# EAGLE design controller_v1 (EAGLE 7.1.0)
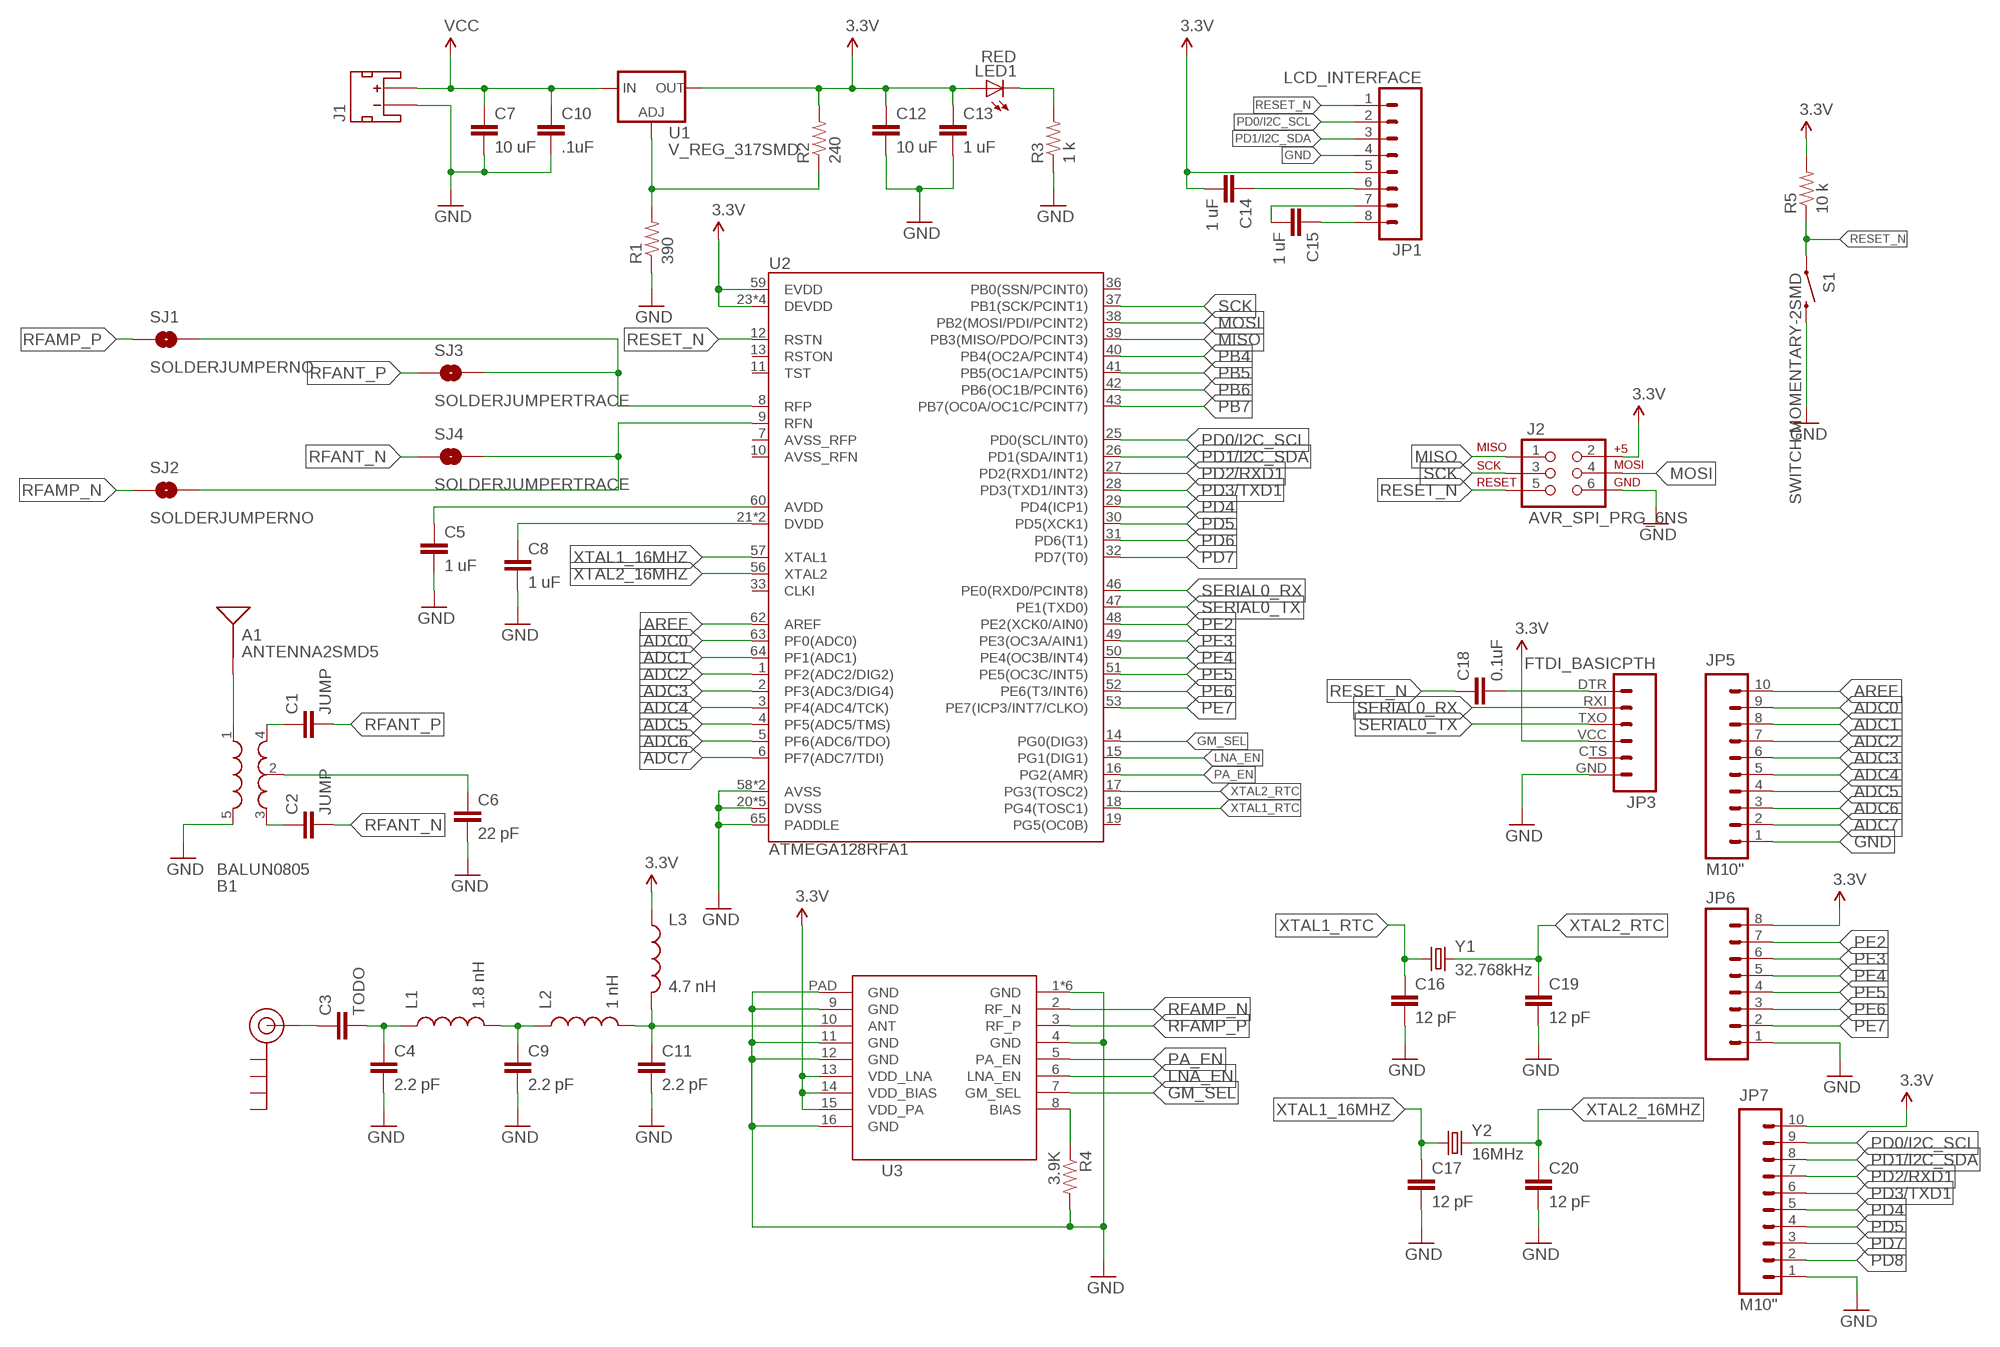
[diagram p0: schematic, sheet 1]

## Parts
A1  ANTENNA2SMD5  [ANTENNA-CHIP5]
B1  BALUN0805  [BALUN]
C1  JUMP  CAP0805  [0805]
C2  JUMP  CAP0805  [0805]
C3  TODO  CAP0805  [0805]
C4  2.2 pF  CAP0805  [0805]
C5  1 uF  CAP0805  [0805]
C6  22 pF  CAP0805  [0805]
C7  10 uF  CAP0805  [0805]
C8  1 uF  CAP0805  [0805]
C9  2.2 pF  CAP0805  [0805]
C10  .1uF  CAP0805  [0805]
C11  2.2 pF  CAP0805  [0805]
C12  10 uF  CAP0805  [0805]
C13  1 uF  CAP0805  [0805]
C14  1 uF  CAP0805  [0805]
C15  1 uF  CAP0805  [0805]
C16  12 pF  CAP0805  [0805]
C17  12 pF  CAP0805  [0805]
C18  0.1uF  CAP0805  [0805]
C19  12 pF  CAP0805  [0805]
C20  12 pF  CAP0805  [0805]
J1  BATT  JST_2MM_MALE  [JST-2-SMD]
J2  AVR_SPI_PRG_6NS  [2X3-NS]
J$1  SMA_EDGE  [SMA-EDGE]
JP1  LCD_INTERFACE  M081X08  [1X08]
JP3  FTDI_BASICPTH  [FTDI_BASIC]
JP5  M10"  [1X10]
JP6  M081X08  [1X08]
JP7  M10"  [1X10]
L1  1.8 nH  INDUCTOR0805  [0805]
L2  1 nH  INDUCTOR0805  [0805]
L3  4.7 nH  INDUCTOR0805  [0805]
LED1  RED  LED0603  [LED-0603]
R1  390  RESISTOR0805-RES  [0805]
R2  240  RESISTOR0805-RES  [0805]
R3  1 k  RESISTOR0805-RES  [0805]
R4  3.9K  RESISTOR0805-RES  [0805]
R5  10 k  RESISTOR0805-RES  [0805]
S1  SWITCH-MOMENTARY-2SMD  [TACTILE_SWITCH_SMD]
SJ1  SOLDERJUMPERNO  [SJ_2S-NO]
SJ2  SOLDERJUMPERNO  [SJ_2S-NO]
SJ3  SOLDERJUMPERTRACE  [SJ_2S-TRACE]
SJ4  SOLDERJUMPERTRACE  [SJ_2S-TRACE]
U1  V_REG_317SMD  [SOT223]
U2  ATMEGA128RFA1  [QFN-64]
U3  RF_AMPLIFIER  CC2592QF  [QFN65P400X400X100-17N]
Y1  32.768kHz  CRYSTAL32-SMD  [CRYSTAL-32KHZ-SMD]
Y2  16MHz  CRYSTAL5X3  [CRYSTAL-SMD-5X3]

## Nets
3.3V: C12.1 C13.1 C14.2 J2.2 JP1.5 JP3.VCC JP6.8 JP7.10 L3.1 LED1.A R2.2 R5.2 U1.2(OUT) U2.23(DEVDD) U2.34(DEVDD) U2.44(DEVDD) U2.54(DEVDD) U2.59(EVDD) U3.13(VDD_LNA) U3.14(VDD_BIAS) U3.15(VDD_PA)
ADC0: JP5.9 U2.63(PF0(ADC0))
ADC1: JP5.8 U2.64(PF1(ADC1))
ADC2: JP5.7 U2.1(PF2(ADC2/DIG2))
ADC3: JP5.6 U2.2(PF3(ADC3/DIG4))
ADC4: JP5.5 U2.3(PF4(ADC4/TCK))
ADC5: JP5.4 U2.4(PF5(ADC5/TMS))
ADC6: JP5.3 U2.5(PF6(ADC6/TDO))
ADC7: JP5.2 U2.6(PF7(ADC7/TDI))
AREF: JP5.10 U2.62(AREF)
GM_SEL: U2.14(PG0(DIG3)) U3.7(GM_SEL)
GND: B1.5(GND) C4.2 C5.2 C6.2 C7.2 C8.2 C9.2 C10.2 C11.2 C12.2 C13.2 C16.2 C17.2 C19.2 C20.2 J1.1(-) J2.6 JP1.4 JP3.GND JP5.1 JP6.1 JP7.1 R1.1 R3.1 R4.2 S1.3 U2.20(DVSS) U2.24(DVSS) U2.35(DVSS) U2.45(DVSS) U2.55(DVSS) U2.58(AVSS) U2.61(AVSS) U2.65(PADDLE) U3.1(GND) U3.4(GND) U3.9(GND) U3.11(GND) U3.12(GND) U3.16(GND) U3.P$1(GND) U3.P$2(GND) U3.P$3(GND) U3.P$4(GND) U3.P$5(GND) U3.PAD(GND)
LNA_EN: U2.15(PG1(DIG1)) U3.6(LNA_EN)
MISO: J2.1 U2.39(PB3(MISO/PDO/PCINT3))
MOSI: J2.4 U2.38(PB2(MOSI/PDI/PCINT2))
N$1: C9.1 L1.2 L2.1
N$2: C18.2 JP3.DTR
N$3: C11.1 L2.2 L3.2 U3.10(ANT)
N$4: C3.2 C4.1 L1.1
N$5: SJ1.2 SJ3.2 U2.8(RFP)
N$6: SJ2.2 SJ4.2 U2.9(RFN)
N$7: R4.1 U3.8(BIAS)
N$8: C3.1 J$1.SIG(SIGNAL)
N$9: B1.4(OUT1) C1.1
N$10: B1.3(OUT2) C2.1
N$11: B1.2(GND) C6.1
N$12: A1.FEED(SIGNAL) B1.1(IN)
N$13: R1.2 R2.1 U1.1(ADJ)
N$14: LED1.C R3.2
N$15: C5.1 U2.60(AVDD)
N$16: C8.1 U2.21(DVDD) U2.22(DVDD)
N$17: C14.1 JP1.6
N$18: C15.2 JP1.7
N$19: C15.1 JP1.8
PA_EN: U2.16(PG2(AMR)) U3.5(PA_EN)
PB4: U2.40(PB4(OC2A/PCINT4))
PB5: U2.41(PB5(OC1A/PCINT5))
PB6: U2.42(PB6(OC1B/PCINT6))
PB7: U2.43(PB7(OC0A/OC1C/PCINT7))
PD0/I2C_SCL: JP1.2 JP7.9 U2.25(PD0(SCL/INT0))
PD1/I2C_SDA: JP1.3 JP7.8 U2.26(PD1(SDA/INT1))
PD2/RXD1: JP7.7 U2.27(PD2(RXD1/INT2))
PD3/TXD1: JP7.6 U2.28(PD3(TXD1/INT3))
PD4: JP7.5 U2.29(PD4(ICP1))
PD5: JP7.4 U2.30(PD5(XCK1))
PD6: U2.31(PD6(T1))
PD7: JP7.3 U2.32(PD7(T0))
PD8: JP7.2
PE2: JP6.7 U2.48(PE2(XCK0/AIN0))
PE3: JP6.6 U2.49(PE3(OC3A/AIN1))
PE4: JP6.5 U2.50(PE4(OC3B/INT4))
PE5: JP6.4 U2.51(PE5(OC3C/INT5))
PE6: JP6.3 U2.52(PE6(T3/INT6))
PE7: JP6.2 U2.53(PE7(ICP3/INT7/CLKO))
RESET_N: C18.1 J2.5 JP1.1 R5.1 S1.1 U2.12(RSTN)
RFAMP_N: SJ2.1 U3.2(RF_N)
RFAMP_P: SJ1.1 U3.3(RF_P)
RFANT_N: C2.2 SJ4.1
RFANT_P: C1.2 SJ3.1
SCK: J2.3 U2.37(PB1(SCK/PCINT1))
SERIAL0_RX: JP3.RXI U2.46(PE0(RXD0/PCINT8))
SERIAL0_TX: JP3.TXO U2.47(PE1(TXD0))
VCC: C7.1 C10.1 J1.2(+) U1.3(IN)
XTAL1_16MHZ: C17.1 U2.57(XTAL1) Y2.1
XTAL1_RTC: C16.1 U2.18(PG4(TOSC1)) Y1.X1
XTAL2_16MHZ: C20.1 U2.56(XTAL2) Y2.3
XTAL2_RTC: C19.1 U2.17(PG3(TOSC2)) Y1.X2
Unconnected: J1.NC1(PAD1) J1.NC2(PAD2) J$1.GND@0(GND) J$1.GND@1(GND) J$1.GND@2(GND) J$1.GND@3(GND) JP3.CTS U2.7(AVSS_RFP) U2.10(AVSS_RFN) U2.11(TST) U2.13(RSTON) U2.19(PG5(OC0B)) U2.33(CLKI) U2.36(PB0(SSN/PCINT0))

## Library data of the parts
A1 = Controller:ANTENNA2: Chip antenna Single endded antenna. Common with smaller chip antennas. CHIP4 package is the GPS Chip Antenna SKU: GPS-08418. CHIP5 package is 2.4GHz chip antenna SKU: WRL-00144.
B1 = Controller:BALUN: 0805 footprint balun- Ember 351/357
C1-C6 C8 C9 C11 C14-C20 = Controller:CAP: Capacitor Standard 0603 ceramic capacitor, and 0.1" leaded capacitor.
C7 C10 C12 C13 = ATmega128RFA1-DevBoard:CAP: Capacitor Standard 0603 ceramic capacitor, and 0.1" leaded capacitor.
J1 = Controller:JST_2MM_MALE: Mates to single-cell LiPo batteries. CONN-08352; PROD_ID: CONN-08352
J2 = Controller:AVR_SPI_PRG_6: AVR ISP 6 Pin This is the reduced ISP connector for AVR programming. Common on Arduino. This footprint will take up less PCB space and can be used with a 10-pin to 6-pin adapter such as SKU: BOB-08508
J$1 = Controller:SMA_EDGE: SMA Antenna Connector End launch SMA connector. The paste layer has been removed so that the connector can be hand soldered onto the board after reflow.
JP1 JP6 = Controller:M08: Header 8 Standard 8-pin 0.1" header. Use with straight break away headers (SKU : PRT-00116), right angle break away headers (PRT-00553), swiss pins (PRT-00743), machine pins (PRT-00117), and female headers (PRT-00115).
JP3 = Controller:FTDI_BASIC: FTDI Basic header with labels
JP5 JP7 = Controller:M10: Header 10 Standard 10-pin 0.1" header. Use with straight break away headers (SKU : PRT-00116), right angle break away headers (PRT-00553), swiss pins (PRT-00743), machine pins (PRT-00117), and female headers (PRT-00115).
L1-L3 = Controller:INDUCTOR: Inductors Basic Inductor/Choke - 0603 and 1206. Footprints are not proven and vary greatly between part numbers. SRN6045- 33uH, 20% 1.4A SDR0403-560KL - 56uH, 10%, 500mA RMS/740mA peak
LED1 = Controller:LED: LEDs Standard schematic elements and footprints for 5mm, 3mm, 1206, and 0603 sized LEDs. 5mm - Spark Fun Electronics SKU : COM-00529 (and others)
R1 R2 = ATmega128RFA1-DevBoard:RESISTOR: Resistor Basic schematic elements and footprints for 0603, 1206, and PTH resistors.
R3-R5 = Controller:RESISTOR: Resistor Basic schematic elements and footprints for 0603, 1206, and PTH resistors.
S1 = Controller:SWITCH-MOMENTARY-2: Various NO switches- pushbuttons, reed, etc
SJ1-SJ4 = Controller:SOLDERJUMPER: Solder Jumper Standard SMD solder jumper. Used to automate production. Two varients : Normally Open and Normally Closed are the same, but have different paste layers. NC will have a large amount of paste and should jumper during reflow.
U1 = Controller:V_REG_317: Voltage Regulator Standard LM317 adjustable voltage regulator. AOI (Adjust Output Input). Google 'LM317 Calculator' for easy to use app to get the two resistor values needed. 240/720 for 5V output. 240/390 for 3.3V output. Spark Fun Electronics SKU : COM-00527
U2 = Controller:ATMEGA128RFA1: ATmega128RFA1 8-bit AVR Microcontroller with Low Power 2.4GHz Transceiver for ZigBee and IEEE 802.15.4
U3 = Controller:CC2592
Y1 Y2 = Controller:CRYSTAL: Various standard crystals. Proven footprints. Spark Fun Electronics SKU : COM-00534

## Board
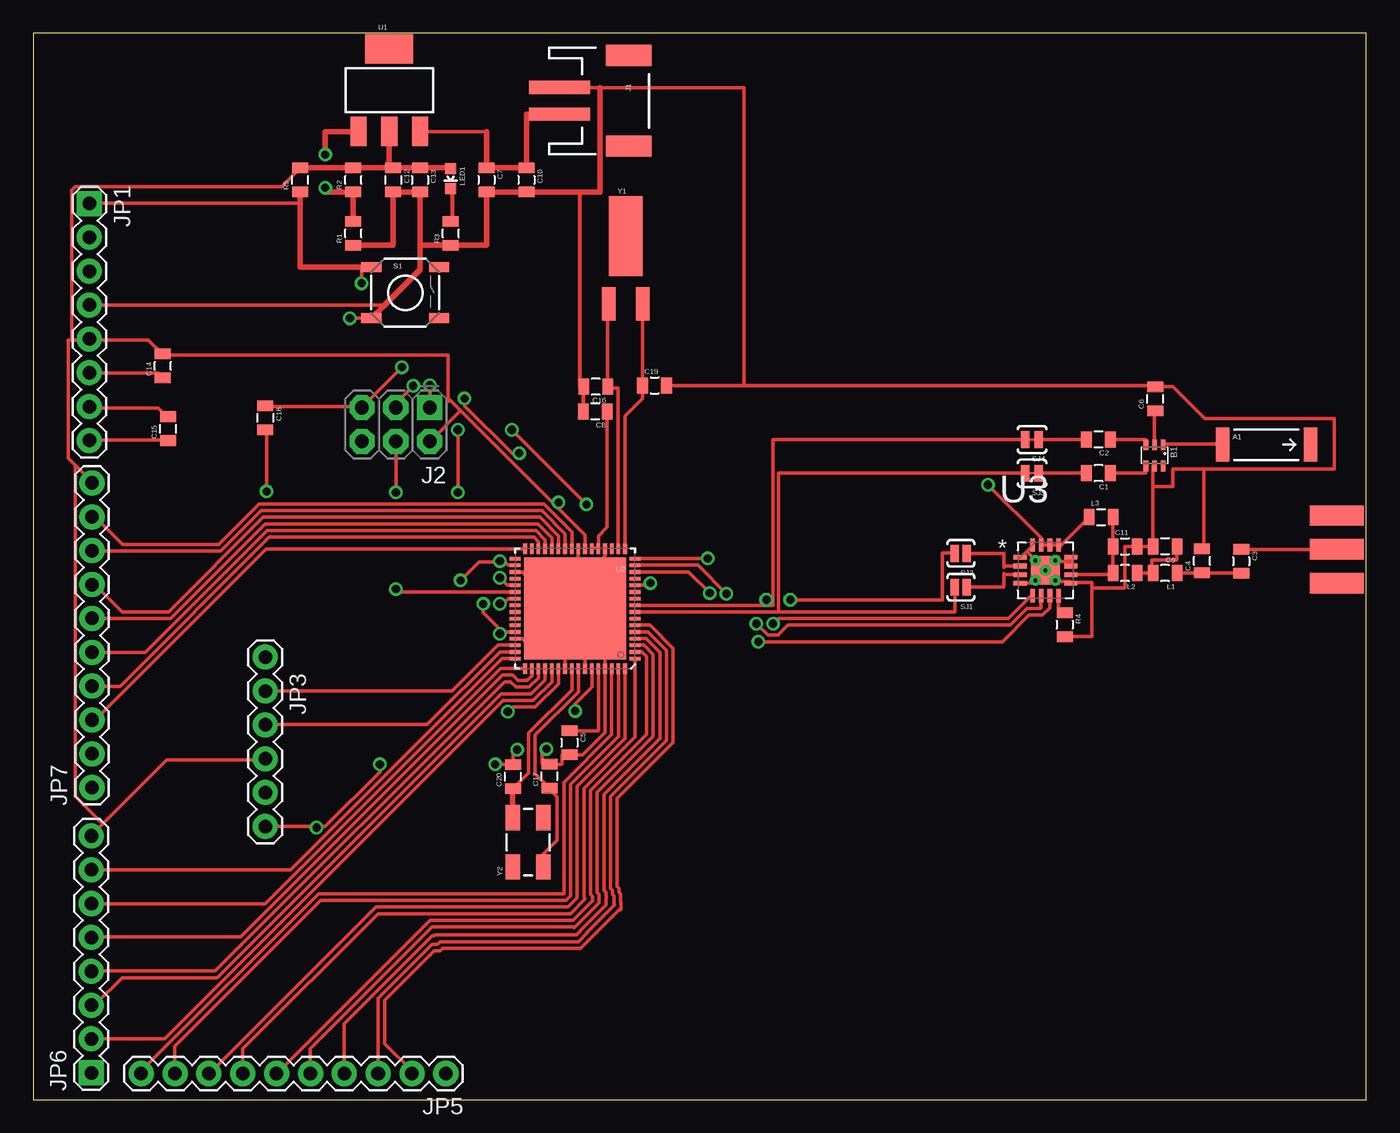
[diagram p1: board, top side]
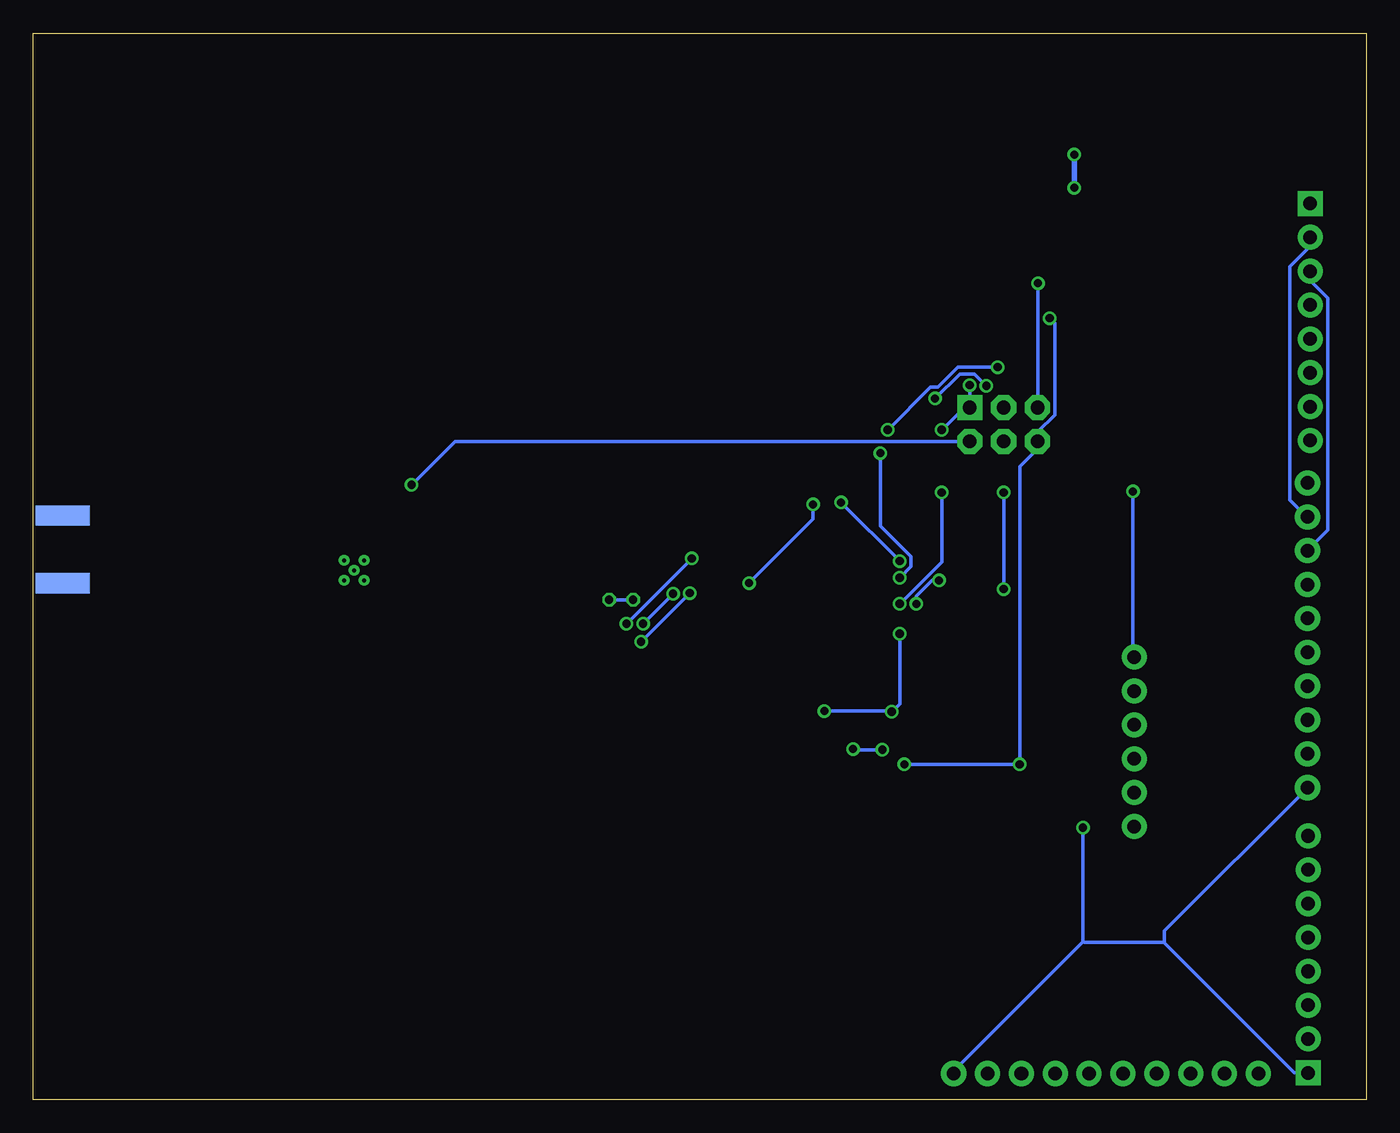
[diagram p2: board, bottom side, seen from below]

Size 100 x 80 mm. Coordinates in mm from the lower left corner, seen from the top.
Outline: 0,0 100,0 100,80 0,80 0,0
Copper layers (1*16): Top 0.035mm / dielectric 1.5mm / Bottom 0.035mm
Design rules "default": minimum track width 10mil, minimum drill 24mil, track to track 8mil, track to pad 8mil, pad to pad 8mil, via to via 8mil, smd to smd 8mil, copper to edge 40mil, drill to drill 8mil, minimum pad ring 10mil, minimum via ring 8mil, stop-mask expansion 4mil, vias tented up to drill 0mil, thermal gap 10mil

### Footprints (pad centres in the part's own frame; a part is rotated, then mirrored left to right if it is on the bottom)
ANTENNA-CHIP5 = smd 1.016 x 2.54: FEED -3.302,0; NC 3.302,0
BALUN = smd 0.35 x 0.8: 1 -0.65,-0.8; 2 0,-0.8; 3 0.65,-0.8; 4 0.65,0.8; 5 0,0.8; 6 -0.65,0.8
0805 = smd 0.8 x 1.2: 1 -0.9,0; 2 0.9,0
JST-2-SMD = smd 1 x 4.6: 1 -1,-3.7; 2 1,-3.7 | smd 1.6 x 3.4: NC1 -3.4,1.5; NC2 3.4,1.5
2X3-NS = drill 1.016 pad 1.88 square: 1 -2.54,-1.27 | drill 1.016 pad 1.88 octagon: 2 -2.54,1.27; 3 0,-1.27; 4 0,1.27; 5 2.54,-1.27; 6 2.54,1.27
SMA-EDGE = smd 1.524 x 4.064: GND@0 0,0; GND@1 5.08,0; SIG 2.54,0 | smd 1.524 x 4.064 bottom: GND@2 0,0; GND@3 5.08,0
1X08 = drill 1.016 pad 1.88 square: 1 0,0 | drill 1.016 pad 1.88: 2 2.54,0; 3 5.08,0; 4 7.62,0; 5 10.16,0; 6 12.7,0; 7 15.24,0; 8 17.78,0
FTDI_BASIC = drill 1.016 pad 1.88: CTS 10.16,0; DTR 0,0; GND 12.7,0; RXI 2.54,0; TXO 5.08,0; VCC 7.62,0
1X10 = drill 1.016 pad 1.88: 1 0,0; 2 2.54,0; 3 5.08,0; 4 7.62,0; 5 10.16,0; 6 12.7,0; 7 15.24,0; 8 17.78,0; 9 20.32,0; 10 22.86,0
LED-0603 = smd 0.8 x 0.8: A 0,-0.75; C 0,0.75
TACTILE_SWITCH_SMD = smd 1.524 x 0.762: 1 -2.54,1.905; 2 2.54,1.905; 3 -2.54,-1.905; 4 2.54,-1.905
SJ_2S-NO = smd 0.635 x 1.27: 1 -0.45,0; 2 0.45,0
SJ_2S-TRACE = smd 0.635 x 1.27: 1 -0.508,0; 2 0.508,0
SOT223 = smd 1.219 x 2.235: 1 -2.311,-3.099; 2 0,-3.099; 3 2.311,-3.099 | smd 3.6 x 2.2: 4 0,3.099
QFN-64 = smd 0.8 x 0.28: 1 -4.5,3.75; 2 -4.5,3.25; 3 -4.5,2.75; 4 -4.5,2.25; 5 -4.5,1.75; 6 -4.5,1.25; 7 -4.5,0.75; 8 -4.5,0.25; 9 -4.5,-0.25; 10 -4.5,-0.75; 11 -4.5,-1.25; 12 -4.5,-1.75; 13 -4.5,-2.25; 14 -4.5,-2.75; 15 -4.5,-3.25; 16 -4.5,-3.75; 33 4.5,-3.75; 34 4.5,-3.25; 35 4.5,-2.75; 36 4.5,-2.25; 37 4.5,-1.75; 38 4.5,-1.25; 39 4.5,-0.75; 40 4.5,-0.25; 41 4.5,0.25; 42 4.5,0.75; 43 4.5,1.25; 44 4.5,1.75; 45 4.5,2.25; 46 4.5,2.75; 47 4.5,3.25; 48 4.5,3.75 | smd 0.28 x 0.8: 17 -3.75,-4.5; 18 -3.25,-4.5; 19 -2.75,-4.5; 20 -2.25,-4.5; 21 -1.75,-4.5; 22 -1.25,-4.5; 23 -0.75,-4.5; 24 -0.25,-4.5; 25 0.25,-4.5; 26 0.75,-4.5; 27 1.25,-4.5; 28 1.75,-4.5; 29 2.25,-4.5; 30 2.75,-4.5; 31 3.25,-4.5; 32 3.75,-4.5; 49 3.75,4.5; 50 3.25,4.5; 51 2.75,4.5; 52 2.25,4.5; 53 1.75,4.5; 54 1.25,4.5; 55 0.75,4.5; 56 0.25,4.5; 57 -0.25,4.5; 58 -0.75,4.5; 59 -1.25,4.5; 60 -1.75,4.5; 61 -2.25,4.5; 62 -2.75,4.5; 63 -3.25,4.5; 64 -3.75,4.5 | smd 7.65 x 7.65: 65 0,0
QFN65P400X400X100-17N = smd 1 x 0.35: 1 -1.9,0.975; 2 -1.9,0.325; 3 -1.9,-0.325; 4 -1.9,-0.975; 9 1.9,-0.975; 10 1.9,-0.325; 11 1.9,0.325; 12 1.9,0.975 | smd 0.35 x 1: 5 -0.975,-1.9; 6 -0.325,-1.9; 7 0.325,-1.9; 8 0.975,-1.9; 13 0.975,1.9; 14 0.325,1.9; 15 -0.325,1.9; 16 -0.975,1.9 | drill 0.3 pad 0.406: P$1 -0.75,0.75; P$2 0.75,0.75; P$3 -0.75,-0.75; P$4 0.75,-0.75; P$5 0,0 | smd 2.16 x 2.16: PAD 0,0
CRYSTAL-32KHZ-SMD = smd 2.5 x 6: SHEILD 0,5.08 | smd 1 x 2.5: X1 -1.27,0; X2 1.27,0
CRYSTAL-SMD-5X3 = smd 1.9 x 1.1: 1 -1.85,-1.15; 2 1.85,-1.15; 3 1.85,1.15; 4 -1.85,1.15

### Placement (x,y rotation side)
A1  92.51,49.13 0 top
B1  84.12,48.33 180 top
C1  79.91,46.99 180 top
C2  79.91,49.53 180 top
C3  90.62,40.38 270 top
C4  87.67,40.42 90 top
C5  40.23,26.77 270 top
C6  84.17,52.57 90 top
C7  34,69 270 top
C8  42.16,51.62 180 top
C9  84.9,41.5 180 top
C10  37,69 270 top
C11  81.9,41.5 0 top
C12  27,69 270 top
C13  29,69 270 top
C14  9.71,55.05 90 top
C15  10.11,50.34 90 top
C16  42.19,53.48 180 top
C17  38.73,24.27 90 top
C18  17.41,51.16 270 top
C19  46.61,53.58 0 top
C20  35.98,24.23 90 top
J1  43.18,74.93 270 top
J2  27.2,50.65 180 top
J$1  97.79,43.82 270 top
JP1  4.21,67.23 270 top
JP3  17.4,33.19 270 top
JP5  30.95,1.95 180 top
JP6  4.35,2 90 top
JP7  4.4,23.4 90 top
L1  84.9,39.5 180 top
L2  81.9,39.5 180 top
L3  80.1,43.7 0 top
LED1  31.3,69.1 180 top
R1  24,65 90 top
R2  24,69 90 top
R3  31.32,65 90 top
R4  77.38,35.63 270 top
R5  20,69 90 top
S1  27.9,60.54 0 top
SJ1  69.59,38.44 180 top
SJ2  69.59,40.98 180 top
SJ3  74.93,46.99 180 top
SJ4  74.93,49.53 180 top
U1  26.71,75.73 0 top
U2  40.64,36.83 180 top
U3  75.94,39.71 0 top
Y1  44.45,59.69 0 top
Y2  37.12,19.31 90 top

### Tracks (layer width: path | path; a pad name or v marks a point on that pad's centre or on a via)
3.3V  (via drill 0.6, 0.61, 0.61 pad 0.61)
  Top 0.254: L3.1 79.15,43.62 77.03,41.5 U3.13 76.9,41.62 76.28,41.62 U3.14 76.15,41.62 75.65,41.62 U3.15 75.62,41.75 75.62,42.12 v71.62,46.12 | 5.19,20.69 10,25.5 17.38,25.5 JP3.VCC | 5.19,20.69 4.38,19.88 JP6.8 | 3.19,47.56 2.62,48.12 2.62,57 2.88,57 | 3.19,47.56 4.38,46.38 JP7.10 | 2.88,57 4.12,57 JP1.5 4.25,57 8.62,57 9.62,56 C14.2 9.75,55.88 31.12,55.88 31.12,52.5 | 2.88,57 2.88,68.25 3.12,68.5 18.62,68.5 19.88,69.75 R5.2 | 5.19,20.69 3.12,22.75 3.12,47.5 3.19,47.56 | 31.12,52.5 31.12,52.38 | 32.06,51.69 31.25,52.5 31.12,52.5 | 32.06,51.69 39.17,44.58 | 39.17,44.58 41.38,42.38 41.38,41.38 U2.23 | 32.06,51.69 J2.2 | U2.54 39.4,32.3 39.4,31.2 37.65,29.45 36,29.45 35.62,29.07 v35.6,29.1 | U2.44 36.1,35.1 35.15,35.1 v35,34.95 35.1,35.2 33.75,36.55 v33.75,37.2 | v39.4,44.8 39.17,44.58 | U2.34 36.1,40.1 35.6,40.1 35.3,40.4 v35,40.4 34.9,40.35 33.45,40.35 v32.05,38.95 | v40.65,29.15 40.65,29.7 41.9,30.95 41.9,32.3 U2.59
  Top 0.406: R5.2 R2.2 C12.1 | C12.1 C13.1 31.3,69.9 LED1.A | C12.1 26.71,69.9 U1.2
  Bottom 0.254: v71.62,46.12 68.38,49.38 J2.2 | v35,34.95 35,29.7 v35.6,29.1 35.7,29.15 v40.65,29.15 | v35,40.4 v39.4,44.8 | v32.05,38.95 32.6,38.95 33.75,37.8 v33.75,37.2
ADC0
  Top 0.254: JP5.9 10.6,1.95 10.6,4 21.55,14.95 39.95,14.95 40.3,15.3 40.3,23.65 43.89,27.24 U2.63 43.9,32.3
ADC1
  Top 0.254: JP5.8 13.2,1.95 25.7,14.45 40.1,14.45 40.8,15.15 40.8,23.5 44.39,27.09 U2.64 44.4,32.3
ADC2
  Top 0.254: JP5.7 15.7,3.8 25.85,13.95 40.3,13.95 41.4,15.05 41.35,15.15 41.3,15.2 41.3,23.35 45.14,27.19 U2.1 45.1,33.05
ADC3
  Top 0.254: JP5.6 29.75,13.45 40.5,13.45 41.95,14.9 41.95,15.2 41.9,15.3 41.8,15.4 41.8,23.2 46,27.4 46,33.25 45.65,33.6 45.15,33.6 U2.2
ADC4
  Top 0.254: JP5.5 20.75,1.95 20.75,3.8 29.9,12.95 40.5,12.95 40.55,12.9 40.65,12.95 42.45,14.75 42.45,15.4 42.3,15.55 42.3,23.05 46.5,27.25 46.5,33.4 45.8,34.1 45.15,34.1 U2.3
ADC5
  Top 0.254: JP5.4 23.3,1.95 23.3,5.7 29.9,12.3 30.05,12.3 30.15,12.35 40.75,12.35 41.05,12.65 41.05,12.7 42.95,14.6 42.95,15.15 43,15.2 42.95,15.3 42.95,15.55 42.8,15.7 42.8,22.9 47,27.1 47,33.55 45.95,34.6 45.15,34.6 U2.4
ADC6
  Top 0.254: JP5.3 25.85,1.95 25.85,7.6 29.9,11.65 30.25,11.65 30.35,11.7 30.5,11.85 40.9,11.85 41.55,12.5 41.55,12.55 43.6,14.6 43.55,14.7 43.55,15.3 43.45,15.4 43.45,15.7 43.3,15.85 43.3,22.75 47.5,26.95 47.5,33.7 46.1,35.1 45.15,35.1 U2.5
ADC7
  Top 0.254: JP5.2 28.4,2.15 26.35,4.2 26.35,7.45 29.75,10.85 29.8,10.85 29.85,10.95 30.05,11.15 30.5,11.15 30.7,11.35 41.05,11.35 43.95,14.25 44.05,14.25 44.1,14.35 44.1,14.75 44.05,14.8 44.05,15.45 43.95,15.55 43.95,15.85 43.8,16 43.8,22.6 48,26.8 48,33.85 46.25,35.6 45.15,35.6 U2.6
AREF
  Top 0.254: JP5.10 8.1,2.15 21.4,15.45 39.8,15.45 39.8,23.8 43.39,27.39 U2.62 43.4,32.3
GM_SEL  (via drill 0.61 pad 0.61)
  Top 0.254: v50.75,38 49.15,39.6 45.15,39.6 U2.14 | v54.4,34.35 72.7,34.35 74.7,36.35 75.7,36.35 76.25,36.9 76.25,37.8 U3.7
  Bottom 0.254: v54.4,34.35 v50.75,38
GND  (via drill 0.61, 0.61 pad 0.61)
  Top 0.254: R4.2 79.4,34.73 79.4,38.4 | 79.4,38.4 79.4,38.8 77.84,38.8 U3.9 77.78,38.88 76.78,38.88 U3.P$4 U3.PAD | 74.53,41.12 74.9,41.5 U3.16 | 74.53,41.12 74.15,40.75 U3.1 | 74.53,41.12 U3.P$1 U3.PAD | 77.9,40.38 77.9,40.62 U3.12 | 77.9,40.38 77.9,40.12 U3.11 | U3.4 74.15,38.75 75.03,38.75 75.15,38.88 U3.PAD | 77.9,40.38 76.78,40.38 U3.PAD | U3.P$3 75.28,39 U3.PAD | 76.03,39.75 U3.PAD | U3.P$2 76.78,40.5 U3.PAD | 79.4,38.4 81.9,38.4 81.9,41.5 C11.2 C9.2 84,46 | 87.8,47.3 97.6,47.3 97.6,51.1 87.9,51.1 85.5,53.5 84.2,53.5 C6.2 84.17,53.58 53.3,53.58 | 87.8,47.3 85.5,47.3 85.5,46 84,46 | B1.5 84,47.53 84,46 | 87.5,41.32 C4.2 87.8,41.32 87.8,47.3 | 47.6,53.5 C19.2 | 47.5,53.7 C19.2 | J1.1 42.5,75.93 53.3,75.93 53.3,53.58 | C19.2 53.3,53.58 | v36.3,26.25 36,25.95 36,25.15 C20.2 35.9,25.15 v34.65,25.15 | v38.5,26.3 38.15,25.95 38.15,25.2 38.2,25.15 38.65,25.15 C17.2 38.85,25.15 39.6,25.15 39.65,25.2 39.65,25.85 40.1,25.85 C5.2 40.25,25.85 41.2,25.85 42.9,27.55 42.9,32.2 U2.61 42.88,32.38 42.88,33.38 42.75,33.5 41.38,33.5 | 21.25,20.5 21.9,20.5 26,24.6 v26,25.15 | 21.25,20.5 JP3.GND | v21.25,20.4 21.25,20.5 | 41.25,33.38 39.88,33.38 39.88,32.38 U2.55 | 41.25,33.38 41.38,33.25 41.38,32.38 U2.58 | 41.38,33.5 41.25,33.5 41.25,33.38 | 41.38,33.5 41.38,36.88 41,36.88 U2.65 | JP1.4 4.25,59.62 26.12,59.62 26.24,59.51 | v23.75,58.62 25.25,58.62 S1.3 | U2.24 40.88,41.25 40.88,36.88 U2.65 | U2.65 39.75,33.4 37.85,33.4 36.65,34.6 36.15,34.6 U2.45 | U2.35 36.15,39.6 36.65,39.6 39.4,36.85 40.55,36.85 U2.65 | U2.65 41,40.45 42.55,40.45 42.9,40.8 42.9,41.3 U2.20
  Top 0.305: C16.2 | C16.2 41,53.48 41,68.1 | C16.2 41.26,53.48 C8.2
  Top 0.406: 42.5,75.93 42.5,68.1 41,68.1 C10.2 C7.2 34,64.1 R3.1 29,64.1 | 29,64.1 C13.2 C12.2 27,64.1 R1.1 | S1.3 26.24,59.51 29,62.27 29,64.1 | 39.48,76 J1.1
  Bottom 0.254: v36.3,26.25 38.45,26.25 v38.5,26.3 | v34.65,25.15 v26,25.15 26,47.5 24.75,48.75 24.75,49.38 J2.6 24.62,49.5 24.62,50.12 23.38,51.38 23.38,58.25 v23.75,58.62 | 21.25,11.85 v21.25,20.4 | 21.25,11.85 30.95,2.15 JP5.1 | JP6.1 5.4,2 15.2,11.8 | 15.2,11.8 21.15,11.8 21.25,11.85 | JP7.1 15.15,12.65 15.15,11.9 15.2,11.8
LNA_EN  (via drill 0.61 pad 0.61)
  Top 0.254: U3.6 75.6,36.9 75.55,36.85 74.55,36.85 73.3,35.6 56.6,35.6 55.95,34.95 55.9,34.85 55.1,34.85 v54.25,35.7 | v52,37.95 49.85,40.1 45.15,40.1 U2.15
  Bottom 0.254: v54.25,35.7 v52,37.95
MISO  (via drill 0.61 pad 0.61)
  Top 0.254: v29.75,53.6 29.75,51.95 J2.1 | v31.85,45.55 v31.85,50.25 | v35,37.2 35.25,37.2 35.65,37.6 36.1,37.6 U2.39
  Bottom 0.254: v29.75,53.6 29.75,52.35 v31.85,50.25 | v31.85,45.55 31.85,40.35 v35,37.2
MOSI  (via drill 0.61 pad 0.61)
  Top 0.254: U2.38 27.2,38.08 v27.2,38.3 | v27.2,45.55 J2.4
  Bottom 0.254: v27.2,38.3 v27.2,45.55
N$1
  Top 0.254: L2.1 L1.2 83.9,39.5 83.9,40.5 85.8,40.5 C9.1
N$2  (via drill 0.61)
  Top 0.254: v17.5,45.62 17.5,50.25 C18.2
  Bottom 0.254: v17.5,45.62 17.5,33.25 JP3.DTR
N$3
  Top 0.254: L3.2 C11.1 L2.2 81,39.38 U3.10
N$4
  Top 0.254: L1.1 87.67,39.5 C4.1 90.62,39.52 C3.2
N$5
  Top 0.254: U2.8 55.9,36.58 | 55.9,36.58 55.9,47 SJ3.2 | 55.9,36.58 69.14,36.58 SJ1.2
N$6  (via drill 0.61)
  Top 0.254: U2.9 55,37.08 | 55,37.08 55.5,37.08 55.5,49.53 SJ4.2 | 55,37.08 v55,37.5 | v56.8,37.5 68.2,37.5 68.2,41 69.14,41 SJ2.2
  Bottom 0.254: v55,37.5 v56.8,37.5
N$7
  Top 0.254: R4.1 76.92,36.53 U3.8
N$8
  Top 0.254: C3.1 J$1.SIG
N$9
  Top 0.254: C1.1 83.47,46.99 B1.4
N$10
  Top 0.254: C2.1 83.47,49.53 B1.3
N$11
  Top 0.254: C6.1 84.12,51.67 B1.2
N$12
  Top 0.254: A1.FEED 89.2,49.2 84.8,49.2 B1.1
N$13  (via drill 0.6)
  Top 0.406: R1.2 R2.1 22,68.1 22,68.3 v21.9,68.4 | U1.1 21.9,72.63 v21.9,70.9
  Bottom 0.406: v21.9,68.4 v21.9,70.9
N$14
  Top 0.305: R3.2 31.4,65.9 31.4,68.4 31.3,68.4 LED1.C
N$15
  Top 0.254: C5.1 40.25,27.65 42.35,27.65 42.4,27.7 42.4,32.3 U2.60
N$16
  Top 0.254: U2.22 42,41.38 42.38,41.38 U2.21 42.4,41.5 42.4,42.3 43.05,42.95 43.05,51.6 C8.1
N$17
  Top 0.254: C14.1 9.62,54.25 9.38,54.5 4.25,54.5 JP1.6
N$18
  Top 0.254: C15.2 10,51.25 9.38,51.88 4.25,51.88 JP1.7
N$19
  Top 0.254: C15.1 10,49.5 4.25,49.5 JP1.8
PA_EN  (via drill 0.61 pad 0.61)
  Top 0.254: 74.9,37.8 U3.5 74.8,37.75 73.15,36.1 55.9,36.1 v55.5,35.7 | v50.6,40.6 45.15,40.6 U2.16
  Bottom 0.254: v55.5,35.7 v50.6,40.6
PD0/I2C_SCL
  Top 0.254: U2.25 40.4,41.35 40.4,42.6 38.3,44.7 16.95,44.7 13.9,41.65 6.7,41.65 4.65,43.7 4.4,43.7 JP7.9
  Bottom 0.254: JP1.2 4.25,64.62 4.25,64 5.75,62.5 5.75,45 4.5,43.75 JP7.9
PD1/I2C_SDA
  Top 0.254: U2.26 39.9,41.35 39.9,42.45 38.15,44.2 17.1,44.2 14.05,41.15 4.4,41.15 JP7.8
  Bottom 0.254: JP1.3 4.12,62.12 4.12,61.38 2.88,60.12 2.88,42.75 4.38,41.25 JP7.8
PD2/RXD1
  Top 0.254: U2.27 39.4,41.35 39.4,42.3 38,43.7 17.25,43.7 10.15,36.6 6.65,36.6 4.65,38.6 4.4,38.6 JP7.7
PD3/TXD1
  Top 0.254: JP7.6 10.3,36.1 17.4,43.2 37.85,43.2 38.9,42.15 38.9,41.35 U2.28
PD4
  Top 0.254: U2.29 38.4,41.35 38.4,42 37.7,42.7 17.55,42.7 8.4,33.55 JP7.5
PD5
  Top 0.254: U2.30 37.9,41.35 37.9,41.85 37.55,42.2 17.7,42.2 6.5,31 4.4,31 JP7.4
PD7
  Top 0.254: U2.32 36.85,41.3 17.45,41.3 4.65,28.5 4.4,28.5 JP7.3
PE2
  Top 0.254: 36.12,33 U2.48 36.05,33.1 35.15,33.1 19.3,17.25 JP6.7
PE3
  Top 0.254: JP6.6 17.4,14.7 35.05,32.35 36.85,32.35 U2.49
PE4
  Top 0.254: JP6.5 4.35,12.2 15.55,12.2 35.2,31.85 35.95,31.85 36.35,31.45 37.05,31.45 37.4,31.8 37.4,32.3 U2.50
PE5
  Top 0.254: JP6.4 4.35,9.65 13.65,9.65 35.35,31.35 35.8,31.35 36.2,30.95 37.2,30.95 37.9,31.65 37.9,32.3 U2.51
PE6
  Top 0.254: U2.52 38.4,32.3 38.4,31.5 37.35,30.45 35.1,30.45 13.8,9.15 6.65,9.15 4.6,7.1 4.35,7.1 JP6.3
PE7
  Top 0.254: JP6.2 9.85,4.55 35.25,29.95 37.5,29.95 38.9,31.35 38.9,32.3 U2.53
RESET_N  (via drill 0.61, 0.61 pad 0.61)
  Top 0.254: C18.1 17.5,52 24.62,52 J2.5 24.75,52.05 v27.65,54.95 | 20,67.25 4.25,67.25 JP1.1 | v24.62,61.25 24.62,62.25 S1.1 | v41.5,44.65 v35.9,50.25 | v46.3,38.75 46.15,38.6 45.15,38.6 U2.12
  Top 0.406: S1.1 20,62.45 20,67.25 R5.1
  Bottom 0.254: v24.62,61.25 24.62,52 J2.5 | v27.65,54.95 30.65,54.95 32.15,53.45 32.7,53.45 v35.9,50.25 | v41.5,44.65 41.5,43.55 v46.3,38.75
RFAMP_N
  Top 0.254: SJ2.1 72.8,40.98 72.8,40.03 | 72.8,40.03 72.8,39.93 | U3.2 72.8,40.03
RFAMP_P
  Top 0.254: SJ1.1 72.8,38.44 72.8,39.38 | U3.3 72.8,39.38 | 72.8,39.38 72.8,39.47
RFANT_N
  Top 0.254: SJ4.1 C2.2
RFANT_P
  Top 0.254: SJ3.1 C1.2
SCK  (via drill 0.61 pad 0.61)
  Top 0.254: J2.3 27.2,52.25 v28.5,53.55 | v32.35,52.6 32.35,52.05 35.9,48.5 v36.45,48.5 | v35,39.15 35.55,38.6 36.1,38.6 U2.37
  Bottom 0.254: v28.5,53.55 29.4,54.45 30.5,54.45 v32.35,52.6 | v36.45,48.5 36.45,43.05 34.15,40.75 34.15,40 v35,39.15
SERIAL0_RX
  Top 0.254: JP3.RXI 31.4,30.65 34.85,34.1 36.1,34.1 U2.46
SERIAL0_TX
  Top 0.254: JP3.TXO 17.4,28.15 29.55,28.15 35,33.6 36.1,33.6 U2.47
VCC
  Top 0.254: 34,72.62 29.12,72.62 U1.3
  Top 0.406: 34,72.63 34,72.62 C7.1 C10.1 37,73.93 J1.2
XTAL1_16MHZ
  Top 0.254: Y2.1 38.25,17.5 38.25,18.4 39.3,19.45 39.3,22.7 38.75,23.25 C17.1 38.65,23.45 37.65,24.45 37.65,27.35 40.9,30.6 40.9,32.3 U2.57
XTAL1_RTC
  Top 0.254: Y1.X1 43.09,59.69 C16.1 43.12,53.38 43.88,53.38 43.88,41.38 U2.18
XTAL2_16MHZ
  Top 0.254: 40.4,32.3 U2.56 40.4,32.2 40.4,30.75 37.15,27.5 37.15,24.5 36.1,23.45 C20.1
  Top 0.406: C20.1 Y2.3
XTAL2_RTC
  Top 0.254: Y1.X2 C19.1 45.7,53.5 45.7,52.6 44.4,51.3 44.4,41.35 U2.17